# EAGLE design OnOnfre_dual_mola_ssr_rev3.4 (EAGLE 8.6.0)
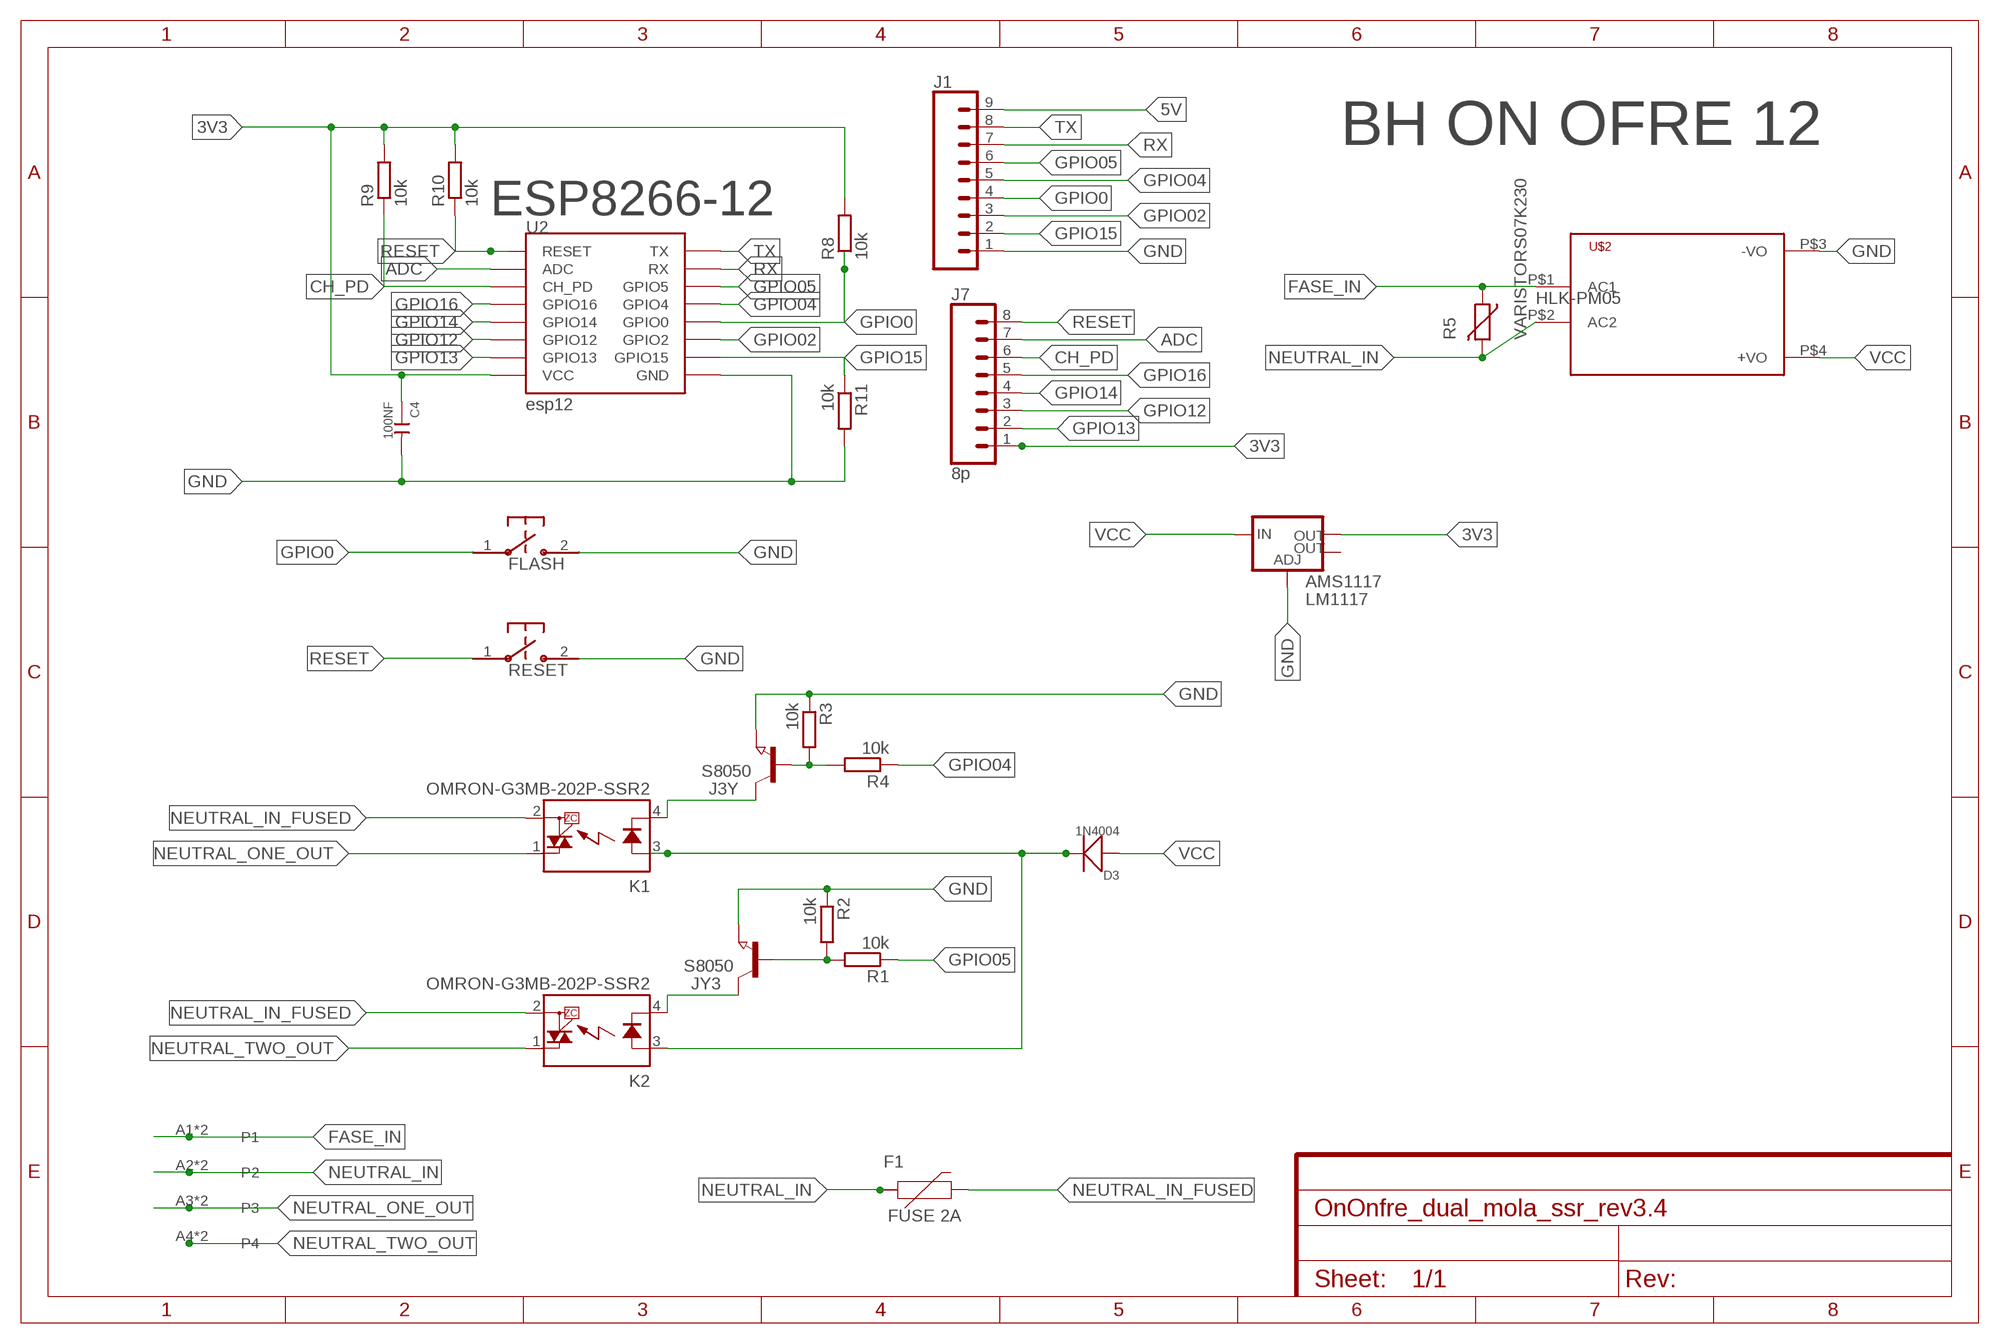
[diagram p0: schematic, sheet 1]

## Parts
AMS1117  LM1117  V_REG_LM1117SOT223  [SOT223]
C4  100NF  CERAMIC-1NF-1KV-10%-X7R(1206)  [C1206]
D3  1N4004  DIODE-GEN-PURPOSE-1KV-1A(DO-214AC)  [DO-214AC]
F1  FUSE 2A  PPTC_PTH  [PTH]
FLASH  B3U-1000P-2P-SMD  B3U-1000P  [B3U-1000P]
J1  CONN_09  [1X09]
J3Y  S8050  NPN-TRANSISTOR_SOT23  [SOT23]
J7  8p  CONN_08"  [1X08]
JY3  S8050  NPN-TRANSISTOR_SOT23  [SOT23]
K1  OMRON-G3MB-202P-SSR2  [OMRON-G3MB-202P-SSR]
K2  OMRON-G3MB-202P-SSR2  [OMRON-G3MB-202P-SSR]
R1  10k  R-EU_R0603  [R0603]
R2  10k  R-EU_R0603  [R0603]
R3  10k  R-EU_R0603  [R0603]
R4  10k  R-EU_R0603  [R0603]
R5  VARISTORS07K230  [S07K230]
R8  10k  R-EU_R0603  [R0603]
R9  10k  R-EU_R0603  [R0603]
R10  10k  R-EU_R0603  [R0603]
R11  10k  R-EU_R0603  [R0603]
RESET  B3U-1000P-2P-SMD  B3U-1000P  [B3U-1000P]
U2  esp12  ESP12SMD  [ESP12-SMD]
U$1  4P4P  [4P]
U$2  HKLPM01  [HKLPM01]

## Nets
3V3: AMS1117.2(OUT) C4.1 J7.1 R8.2 R9.2 R10.2 U2.VCC
5V: D3.2(-) J1.9 K1.3(A) K2.3(A)
ADC: J7.7 U2.ADC
CH_PD: J7.6 R9.1 U2.CH_PD
FASE_IN [220V]: R5.1 U$1.A1(P1) U$1.B1(P1) U$2.P$1(AC1)
GND: AMS1117.1(ADJ) C4.2 FLASH.2 J1.1 J3Y.2(E) JY3.2(E) R2.1 R3.1 R11.2 RESET.2 U2.GND U$2.P$3(-VO)
GPIO0: FLASH.1 J1.4 R8.1 U2.GPIO0
GPIO02: J1.3 U2.GPIO2
GPIO04: J1.5 R4.1 U2.GPIO4
GPIO05: J1.6 R1.1 U2.GPIO5
GPIO12: J7.3 U2.GPIO12
GPIO13: J7.2 U2.GPIO13
GPIO14: J7.4 U2.GPIO14
GPIO15: J1.2 R11.1 U2.GPIO15
GPIO16: J7.5 U2.GPIO16
N$1: J3Y.3(C) K1.4(K)
N$7: J3Y.1(B) R3.2 R4.2
N$9: JY3.3(C) K2.4(K)
N$13: JY3.1(B) R1.2 R2.2
NEUTRAL_IN [220V]: F1.P$1 R5.2 U$1.A2(P2) U$1.B2(P2) U$2.P$2(AC2)
NEUTRAL_IN_FUSED: F1.P$2 K1.2(DS2) K2.2(DS2)
NEUTRAL_ONE_OUT [220V]: K1.1(DS1) U$1.A3(P3) U$1.B3(P3)
NEUTRAL_TWO_OUT [220V]: K2.1(DS1) U$1.A4(P4) U$1.B4(P4)
RESET: J7.8 R10.1 RESET.1 U2.RESET
RX: J1.7 U2.RXD0(RX)
TX: J1.8 U2.TXD0(TX)
VCC: AMS1117.3(IN) D3.1(+) U$2.P$4(+VO)
Unconnected: AMS1117.4(OUT)

## Notes on the sheet
- BH ON OFRE 12
- ESP8266-12
- HLK-PM05

## Library data of the parts
AMS1117 = SparkFun-IC-Power:V_REG_LM1117: Voltage Regulator LM1117 Standard adjustable voltage regulator but in SMD form. Spark Fun Electronics SKU : COM-00595; PROD_ID: VREG-08170
C4 = Seeed-Capacitor:CERAMIC-1NF-1KV-10%-X7R?(1206): 302010189; MPN: CC1206KKX7RCBB102; VALUE: 1NF
D3 = Seeed-Diode:DIODE-GEN-PURPOSE-1KV-1A(DO-214AC): 304010013; MPN: 1N4007; VALUE: 1N4007
F1 = SparkFun-Fuses:PPTC: Resettable Fuse PPTC Resettable Fuse. Really a sort of resistor with a polymeric positive temperature coefficient whose resistance increases dramatically with an increase in temperature. When heated by the power passing through the resistance rises causing the current to be limited, protecting the circuit. This is achieved by the transition of the polymer from a crystalline to an amorphous state where the conductive carbon separates breaking the conductive pathways found in the cool crystalline structure. When a PPTC cools back down it resumes conducting letting the circuit turn back on. SparkFun Products: SparkFun RedBoard - Programmed with Arduino <https://www.sparkfun.com/products/12757> Pro Micro - 5V/16MHz <https://www.sparkfun.com/products/12640> Arduino Pro 328 - 5V/16MHz <https://www.sparkfun.com/products/10915> MP3 Trigger <https://www.sparkfun.com/products/13720>; PROD_ID: RES-08490; VALUE: 72V/0.25A
FLASH RESET = switches:B3U: Switch; DIGIKEY: SW1020CT-ND; MANUFACTURER: Omron; MPN: B3U-1000P
J1 = SparkFun-Connectors:CONN_09: Multi connection point. Often used as Generic Header-pin footprint for 0.1 inch spaced/style header connections On any of the 0.1 inch spaced packages, you can populate with these: Break Away Headers - Straight <https://www.sparkfun.com/products/116> (PRT-00116) Break Away Male Headers - Right Angle <https://www.sparkfun.com/products/553> (PRT-00553) Female Headers <https://www.sparkfun.com/products/115> (PRT-00115) Break Away Headers - Machine Pin <https://www.sparkfun.com/products/117> (PRT-00117) Break Away Female Headers - Swiss Machine Pin <https://www.sparkfun.com/products/743> (PRT-00743) For SCREWTERMINALS and SPRING TERMINALS visit here: Screw Terimnals on SparkFun.com <https://www.sparkfun.com/search/results?term=Screw+Terminals> (5mm/3.5mm/2.54mm spacing) This device is also useful as a general connection point to wire up your design to another part of your project. Our various solder wires solder well into these plated through hole pads. Hook-Up Wire - Assortment (Stranded, 22 AWG) <https://www.sparkfun.com/products/11375> (PRT-11375) Hook-Up Wire - Assortment (Solid Core, 22 AWG) <https://www.sparkfun.com/products/11367> (PRT-11367) View the entire wire category on our website here <https://www.sparkfun.com/categories/141> Special notes: Molex polarized connector foot print use with SKU : PRT-08231 with associated crimp pins and housings. 1MM SMD Version SKU: PRT-10208 NOTES ON THE VARIANTS LOCK and LOCK_LONGPADS... This footprint was designed to help hold the alignment of a through-hole component (i.e. 6-pin header) while soldering it into place. You may notice that each hole has been shifted either up or down by 0.005 of an inch from it's more standard position (which is a perfectly straight line). This slight alteration caused the pins (the squares in the middle) to touch the edges of the holes. Because they are alternating, it causes a "brace" to hold the component in place. 0.005 has proven to be the perfect amount of "off-center" position when using our standard breakaway headers. Although looks a little odd when you look at the bare footprint, once you have a header in there, the alteration is very hard to notice. Also,if you push a header all the way into place, it is covered up entirely on the bottom side.
J3Y JY3 = semicon-smd-ipc:NPN-TRANSISTOR_: NPN TRANSISTOR
J7 = SparkFun-Connectors:CONN_08: Multi connection point. Often used as Generic Header-pin footprint for 0.1 inch spaced/style header connections On any of the 0.1 inch spaced packages, you can populate with these: Break Away Headers - Straight <https://www.sparkfun.com/products/116> (PRT-00116) Break Away Male Headers - Right Angle <https://www.sparkfun.com/products/553> (PRT-00553) Female Headers <https://www.sparkfun.com/products/115> (PRT-00115) Break Away Headers - Machine Pin <https://www.sparkfun.com/products/117> (PRT-00117) Break Away Female Headers - Swiss Machine Pin <https://www.sparkfun.com/products/743> (PRT-00743) Arduino Stackable Header - 8 Pin <https://www.sparkfun.com/products/9279> (PRT-09279) For SCREWTERMINALS and SPRING TERMINALS visit here: Screw Terimnals on SparkFun.com <https://www.sparkfun.com/search/results?term=Screw+Terminals> (5mm/3.5mm/2.54mm spacing) This device is also useful as a general connection point to wire up your design to another part of your project. Our various solder wires solder well into these plated through hole pads. Hook-Up Wire - Assortment (Stranded, 22 AWG) <https://www.sparkfun.com/products/11375> (PRT-11375) Hook-Up Wire - Assortment (Solid Core, 22 AWG) <https://www.sparkfun.com/products/11367> (PRT-11367) View the entire wire category on our website here <https://www.sparkfun.com/categories/141> Special notes: Molex polarized connector foot print use with SKU : PRT-08231 with associated crimp pins and housings. 1MM SMD Version SKU: PRT-10208 NOTES ON THE VARIANTS LOCK and LOCK_LONGPADS... This footprint was designed to help hold the alignment of a through-hole component (i.e. 6-pin header) while soldering it into place. You may notice that each hole has been shifted either up or down by 0.005 of an inch from it's more standard position (which is a perfectly straight line). This slight alteration caused the pins (the squares in the middle) to touch the edges of the holes. Because they are alternating, it causes a "brace" to hold the component in place. 0.005 has proven to be the perfect amount of "off-center" position when using our standard breakaway headers. Although looks a little odd when you look at the bare footprint, once you have a header in there, the alteration is very hard to notice. Also,if you push a header all the way into place, it is covered up entirely on the bottom side.; PROD_ID: CONN-08438
K1 K2 = Omron G3MB 202p SSR:OMRON-G3MB-202P-SSR: IT(rms) 8A, Zero Cross type SIP 4pin Triac output SSR Source: http://sharp-world.com/products/device/lineup/data/pdf/datasheet/s102s02_e.pdf; MPN: S202S02F; OC_FARNELL: 1618475; OC_NEWARK: 14N9588
R1-R4 R8-R11 = resistor:R-EU_: RESISTOR, European symbol
R5 = varistor:VARISTOR: VARISTOR
U2 = esp8266modules:ESP12: ESP8266 Wifi module 12
U$1 = 4po:4P
U$2 = HKLPM01:HKLPM01

## Net classes
1 220V: width 1.27 mm, clearance 2 mm

## Board
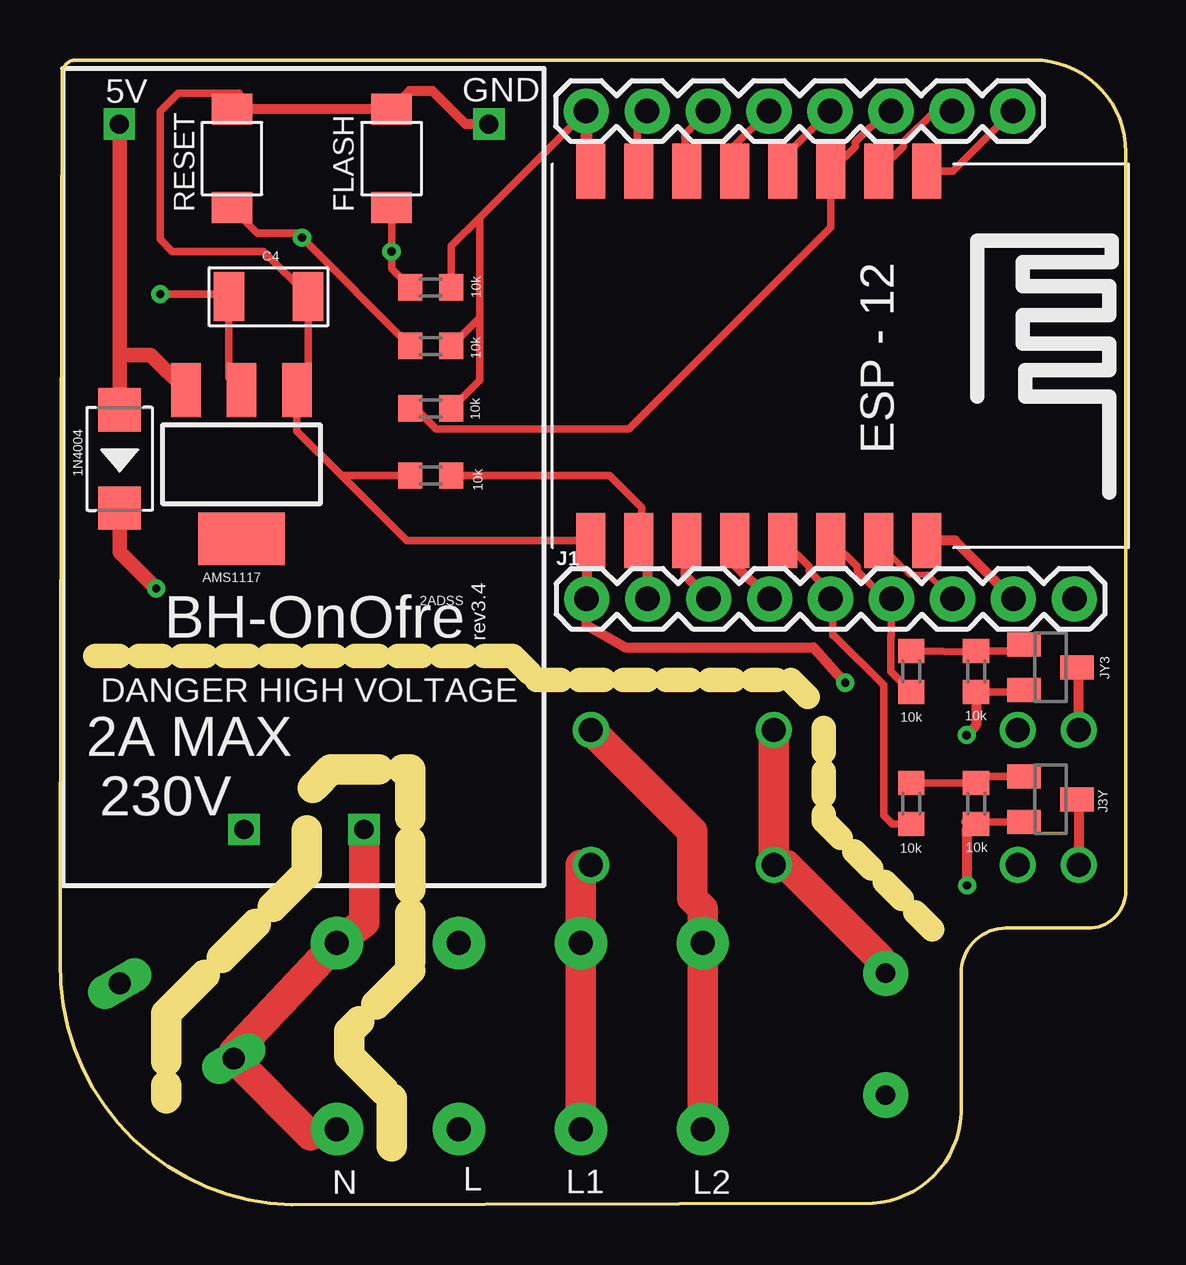
[diagram p1: board, top side]
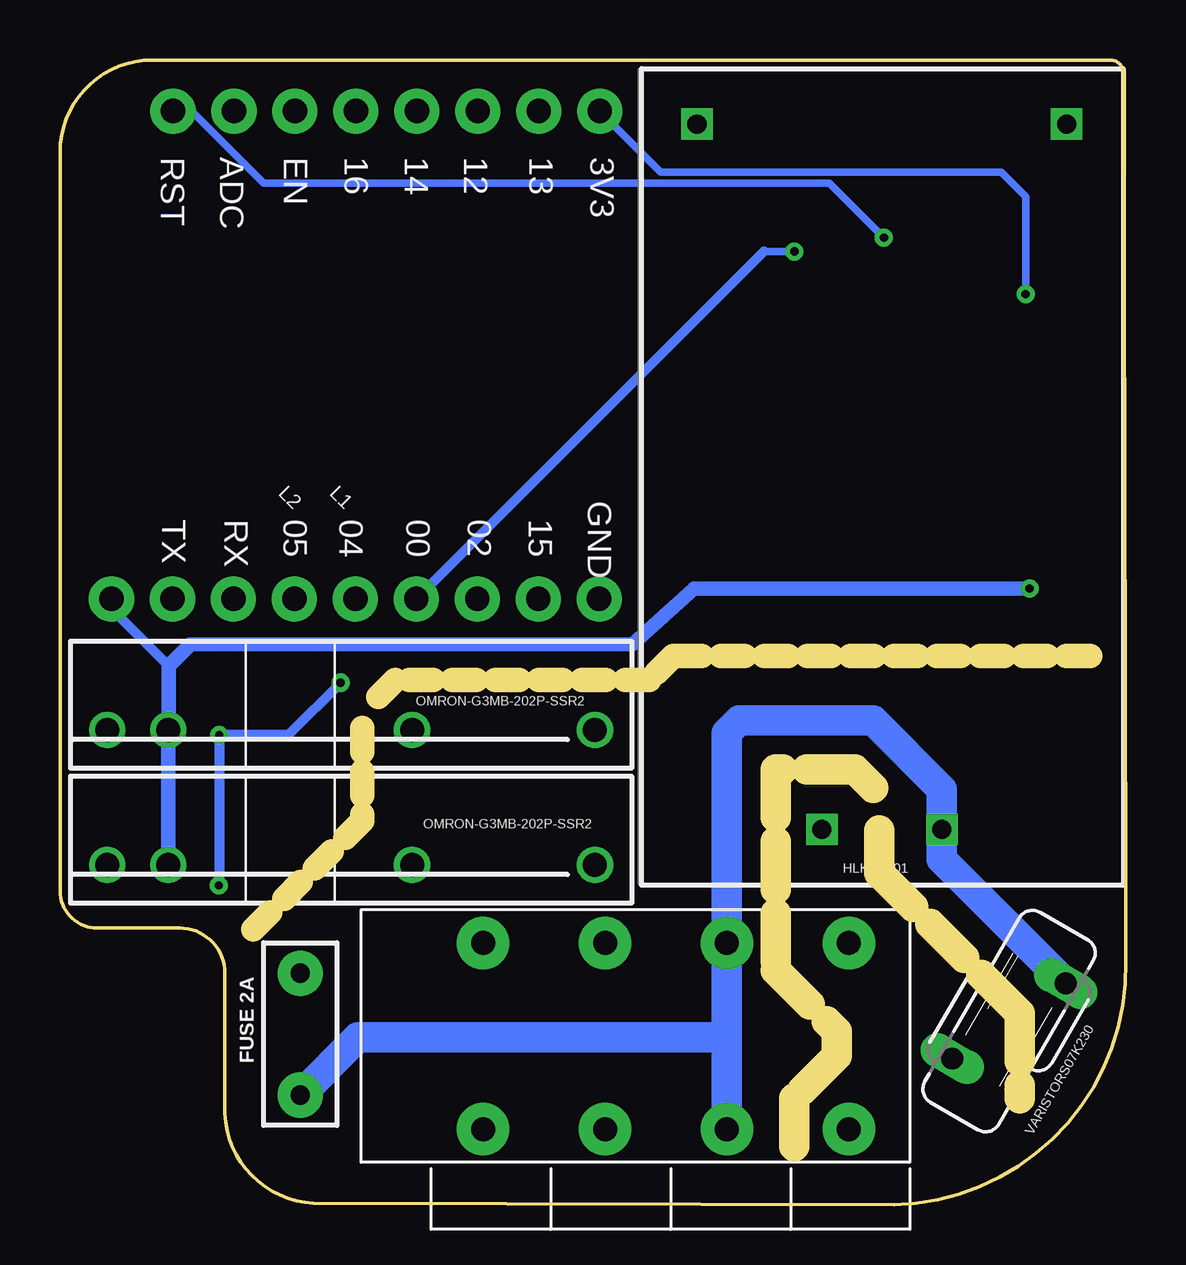
[diagram p2: board, bottom side, seen from below]

Size 44.41 x 47.73 mm. Coordinates in mm from the lower left corner, seen from the top.
Outline: 0.01,13.43 0.01,13.34
Outline: 0.01,13.34 0.01,10.14 arc90 9.66,0 33.86,0.08 arc90 37.54,4.17 37.54,9.66 arc-90 39.42,11.54 42.86,11.54 arc90 44.41,13.1 44.41,43.89 arc90 40.57,47.73 0.67,47.73 arc90 0.09,47.16 0,13.43 arc-90 0.01,13.34
Copper layers (1*16): Top 0.035mm / dielectric 1.5mm / Bottom 0.035mm
Design rules "default": minimum track width 6mil, minimum drill 0.35mm, track to track 6mil, track to pad 6mil, pad to pad 6mil, via to via 6mil, smd to smd 6mil, copper to edge 40mil, drill to drill 6mil, minimum pad ring 10mil, minimum via ring 8mil, stop-mask expansion 4mil, vias tented up to drill 0mil, thermal gap 10mil
Milling: 42 lines

### Footprints (pad centres in the part's own frame; a part is rotated, then mirrored left to right if it is on the bottom)
SOT223 = smd 1.219 x 2.235: 1 -2.311,-3.099; 2 0,-3.099; 3 2.311,-3.099 | smd 3.6 x 2.2: 4 0,3.099
C1206 = smd 1.27 x 2.032: 1 -1.651,0; 2 1.651,0
DO-214AC = smd 1.8 x 1.77: 1 -2.042,0; 2 2.042,0
PTH = drill 0.8 pad 1.88: P$1 -2.54,0; P$2 2.54,0
B3U-1000P = smd 1.283 x 1.7: 1 -2.056,0; 2 2.056,0
1X09 = drill 1.016 pad 1.88: 1 0,0; 2 2.54,0; 3 5.08,0; 4 7.62,0; 5 10.16,0; 6 12.7,0; 7 15.24,0; 8 17.78,0; 9 20.32,0
SOT23 = smd 1 x 1.4: 1 -0.95,-1.1; 2 0.95,-1.1; 3 0,1.1
1X08 = drill 1.016 pad 1.88: 1 0,0; 2 2.54,0; 3 5.08,0; 4 7.62,0; 5 10.16,0; 6 12.7,0; 7 15.24,0; 8 17.78,0
OMRON-G3MB-202P-SSR = drill 1: 1 -12.7,0; 2 -5.08,0; 3 5.08,0; 4 7.62,0
R0603 = smd 1 x 1.1: 1 -0.85,0; 2 0.85,0
S07K230 = drill 0.914 long: 1 -1.27,-2.54; 2 1.27,2.54
ESP12-SMD = smd 2.286 x 1.2: ADC -7.792,3.8; CH_PD -7.792,1.8; GND 7.592,-8.2; GPIO0 7.592,-2.2; GPIO2 7.592,-4.2; GPIO4 7.592,-0.2; GPIO5 7.592,1.8; GPIO12 -7.792,-4.2; GPIO13 -7.792,-6.2; GPIO14 -7.792,-2.2; GPIO15 7.592,-6.2; GPIO16 -7.792,-0.2; RESET -7.792,5.8; RXD0 7.592,3.8; TXD0 7.592,5.8; VCC -7.792,-8.2
4P = drill 1 pad 2.184: A1 1.397,20.32; A2 1.397,15.24; A3 1.397,10.16; A4 1.397,5.08; B1 9.152,20.32; B2 9.152,15.24; B3 9.152,10.16; B4 9.152,5.08
HKLPM01 = drill 0.8 square: P$1 -14.7,2.5; P$2 -14.7,-2.5; P$3 14.7,7.7; P$4 14.7,-7.7

### Placement (x,y rotation side)
AMS1117  7.56,30.87 180 top
C4  8.69,37.86 0 top
D3  2.48,31.1 270 top
F1  34.4,7.12 90 bottom
FLASH  13.81,43.62 90 top
J1  21.95,25.26 0 top
J3Y  41.27,16.91 270 top
J7  21.92,45.6 0 top
JY3  41.27,22.41 270 top
K1  34.82,14.18 180 bottom
K2  34.82,19.8 180 bottom
R1  35.47,22.23 90 top
R2  38.17,22.23 90 top
R3  38.17,16.73 90 top
R4  35.47,16.73 90 top
R5  4.87,7.67 330 bottom
R8  15.45,38.25 0 top
R9  15.45,33.2 0 top
R10  15.45,35.81 0 top
R11  15.45,30.4 180 top
RESET  7.17,43.62 90 top
U2  30.32,35.3 270 top
U$1  31.86,12.31 270 bottom
U$2  10.17,30.35 90 bottom

### Tracks (layer width: path | path; a pad name or v marks a point on that pad's centre or on a via)
3V3  (via drill 0.35)
  Top 0.305: AMS1117.2 7.04,34.5 C4.1 6.93,37.97 v4.18,37.97 | R8.2 16.3,39.98 17.49,41.17 | 17.49,41.17 J7.1 | R10.2 17.49,36.99 | 17.49,36.99 17.49,41.17 | R9.2 17.49,34.39 17.49,36.99
  Top 0.508: J7.1 21.92,43.14 U2.VCC
  Bottom 0.305: J7.1 19.37,43.05 5.19,43.05 4.18,42.03 v4.18,37.97
5V  (via drill 0.35)
  Top 0.61: D3.2 2.48,27.22 v4.01,25.7
  Bottom 0.406: 39.89,22.46 42.27,24.84 J1.9
  Bottom 0.61: v4.01,25.7 17.98,25.7 20.56,23.39 38.98,23.37 39.89,22.46 39.89,19.82 K2.3 K1.3 | K1.3
ADC
  Top 0.305: U2.ADC 35.13,44.12 35.13,44.3 36.44,45.6 J7.7
CH_PD
  Top 0.305: J7.6 34.44,45.6 33.13,44.3 33.13,44.12 U2.CH_PD 32.12,40.77 23.7,32.35 15.68,32.35 14.82,33.2 R9.1
FASE_IN
  Top 1.27: U$2.P$1 12.67,11.79 U$1.A1 7.24,6.36 R5.1 10.43,2.91 U$1.B1
GND  (via drill 0.35)
  Top 0.305: R2.1 40.3,21.38 JY3.2 | 37.71,15.96 R3.1 38.09,15.96 J3Y.2 | R11.2 11.74,30.4 | 11.74,30.4 9.87,32.27 AMS1117.1 10.34,34.43 C4.2 10.34,37.9 8.49,39.75 4.68,39.75 4.18,40.25 4.18,45.59 4.94,46.35 7.48,46.35 7.48,46.19 7.99,45.68 | U2.GND 14.44,27.7 11.74,30.4
  Top 0.406: R2.1 38.17,19.99 v37.78,19.59 | v37.8,13.32 37.8,15.67 R3.1 | v32.72,21.77 31.4,23.24 23.55,23.24 21.95,24.16 J1.1 21.95,27.53 U2.GND | U$2.P$3 16.9,45.05 15.52,46.43 14.57,46.43 FLASH.2 7.99,45.68 RESET.2
  Bottom 0.406: v37.8,13.32 37.78,13.34 v37.78,19.59 34.9,19.59 v32.72,21.77
GPIO0  (via drill 0.35)
  Top 0.305: 28.04,26.79 28.06,27.07 U2.GPIO0 | R8.1 13.81,39.03 v13.81,39.75 FLASH.1
  Top 0.406: J1.4 28.06,26.77 28.06,27.07
  Bottom 0.305: v13.81,39.75 15.08,39.75
  Bottom 0.406: 15.08,39.75 J1.4
GPIO02
  Top 0.305: 26.04,26.25 26.08,27.04 U2.GPIO2
  Top 0.406: J1.3 26.08,26.21 26.08,27.04
GPIO04
  Top 0.305: R4.1 34.67,15.88 34.32,16.24 34.32,21.68 32.25,23.75 32.2,23.75 32.2,25.01 32.2,25.17 | U2.GPIO4 31.22,26.61 31.22,26.43 32.2,25.45 32.2,25.17 | J1.5 32.2,25.17
GPIO05
  Top 0.305: U2.GPIO5 33.22,26.61 33.22,26.43 34.39,25.26 J1.6 34.65,23.74 34.61,23.71 34.61,22.24 R1.1
GPIO12
  Top 0.305: U2.GPIO12 26.04,44.64 J7.3
GPIO13
  Top 0.305: U2.GPIO13 24.04,45.18 J7.2
GPIO14
  Top 0.305: U2.GPIO14 28.04,44.1 J7.4
GPIO15
  Top 0.305: R11.1 22.91,30.4 24.24,29.08 24.24,28.06 24.49,27.82 24.49,27.34 24.49,27.05 | U2.GPIO15
  Top 0.406: J1.2 24.49,27.34 U2.GPIO15
GPIO16
  Top 0.305: U2.GPIO16 30.04,43.56 J7.5
N$1
  Top 0.406: J3Y.3 42.44,16.84 K1.4
N$7
  Top 0.305: J3Y.1 38.29,17.86 38.18,17.75 R3.2 R4.2
N$9
  Top 0.406: K2.4 42.44,22.34 JY3.3
N$13
  Top 0.305: R1.2 38.15,23.06 R2.2 40.1,23.08 JY3.1
NEUTRAL_IN
  Bottom 1.27: 16.62,6.98 U$1.A2 16.62,19.68 16.11,20.19 10.53,20.19 7.67,17.33 U$2.P$2 7.67,14.4 R5.2 | 16.62,6.98 U$1.B2 | F1.P$1 32,6.98 16.62,6.98
NEUTRAL_IN_FUSED
  Top 1.27: K2.2 K1.2 | K1.2 | K1.2 30.25,14.18 34.15,10.28 34.15,9.91 F1.P$2
NEUTRAL_ONE_OUT
  Top 1.27: K1.1 21.7,14.18 U$1.A3 U$1.B3
NEUTRAL_TWO_OUT
  Top 1.27: K2.1 26.35,15.57 26.35,12.77 26.78,12.35 U$1.A4 U$1.B4
RESET  (via drill 0.35)
  Top 0.305: RESET.1 8.23,40.51 9.9,40.51 v10.09,40.32 R10.1 | U2.RESET 37.19,43.09 J7.8
  Bottom 0.305: v10.09,40.32 12.35,42.59 35.91,42.59 38.92,45.6 J7.8
RX
  Top 0.254: U2.RXD0 34.05,27.64 34.05,27.1 34.59,27.1 35.4,26.28 36.17,26.28 J1.7
TX
  Top 0.406: J1.8 37.29,27.7 U2.TXD0
VCC
  Top 0.61: D3.1 2.48,35.43 | 2.48,35.43 2.48,45.04 U$2.P$4 | 2.48,35.43 3.79,35.43 AMS1117.3

### Text on the board
tNames: 5V | GND | 2ADSS | BH-OnOfre | rev3.4 | DANGER HIGH VOLTAGE | 2A MAX | 230V | L1 | N | L | L2
bNames: 3V3 | 13 | 12 | 14 | 16 | EN | ADC | RST | GND | L1 | L2 | 15 | 02 | 00 | 04 | 05 | RX | TX | HLK-PM01